# EAGLE schematic ChargerControlSchematicV1 (EAGLE 6.2)
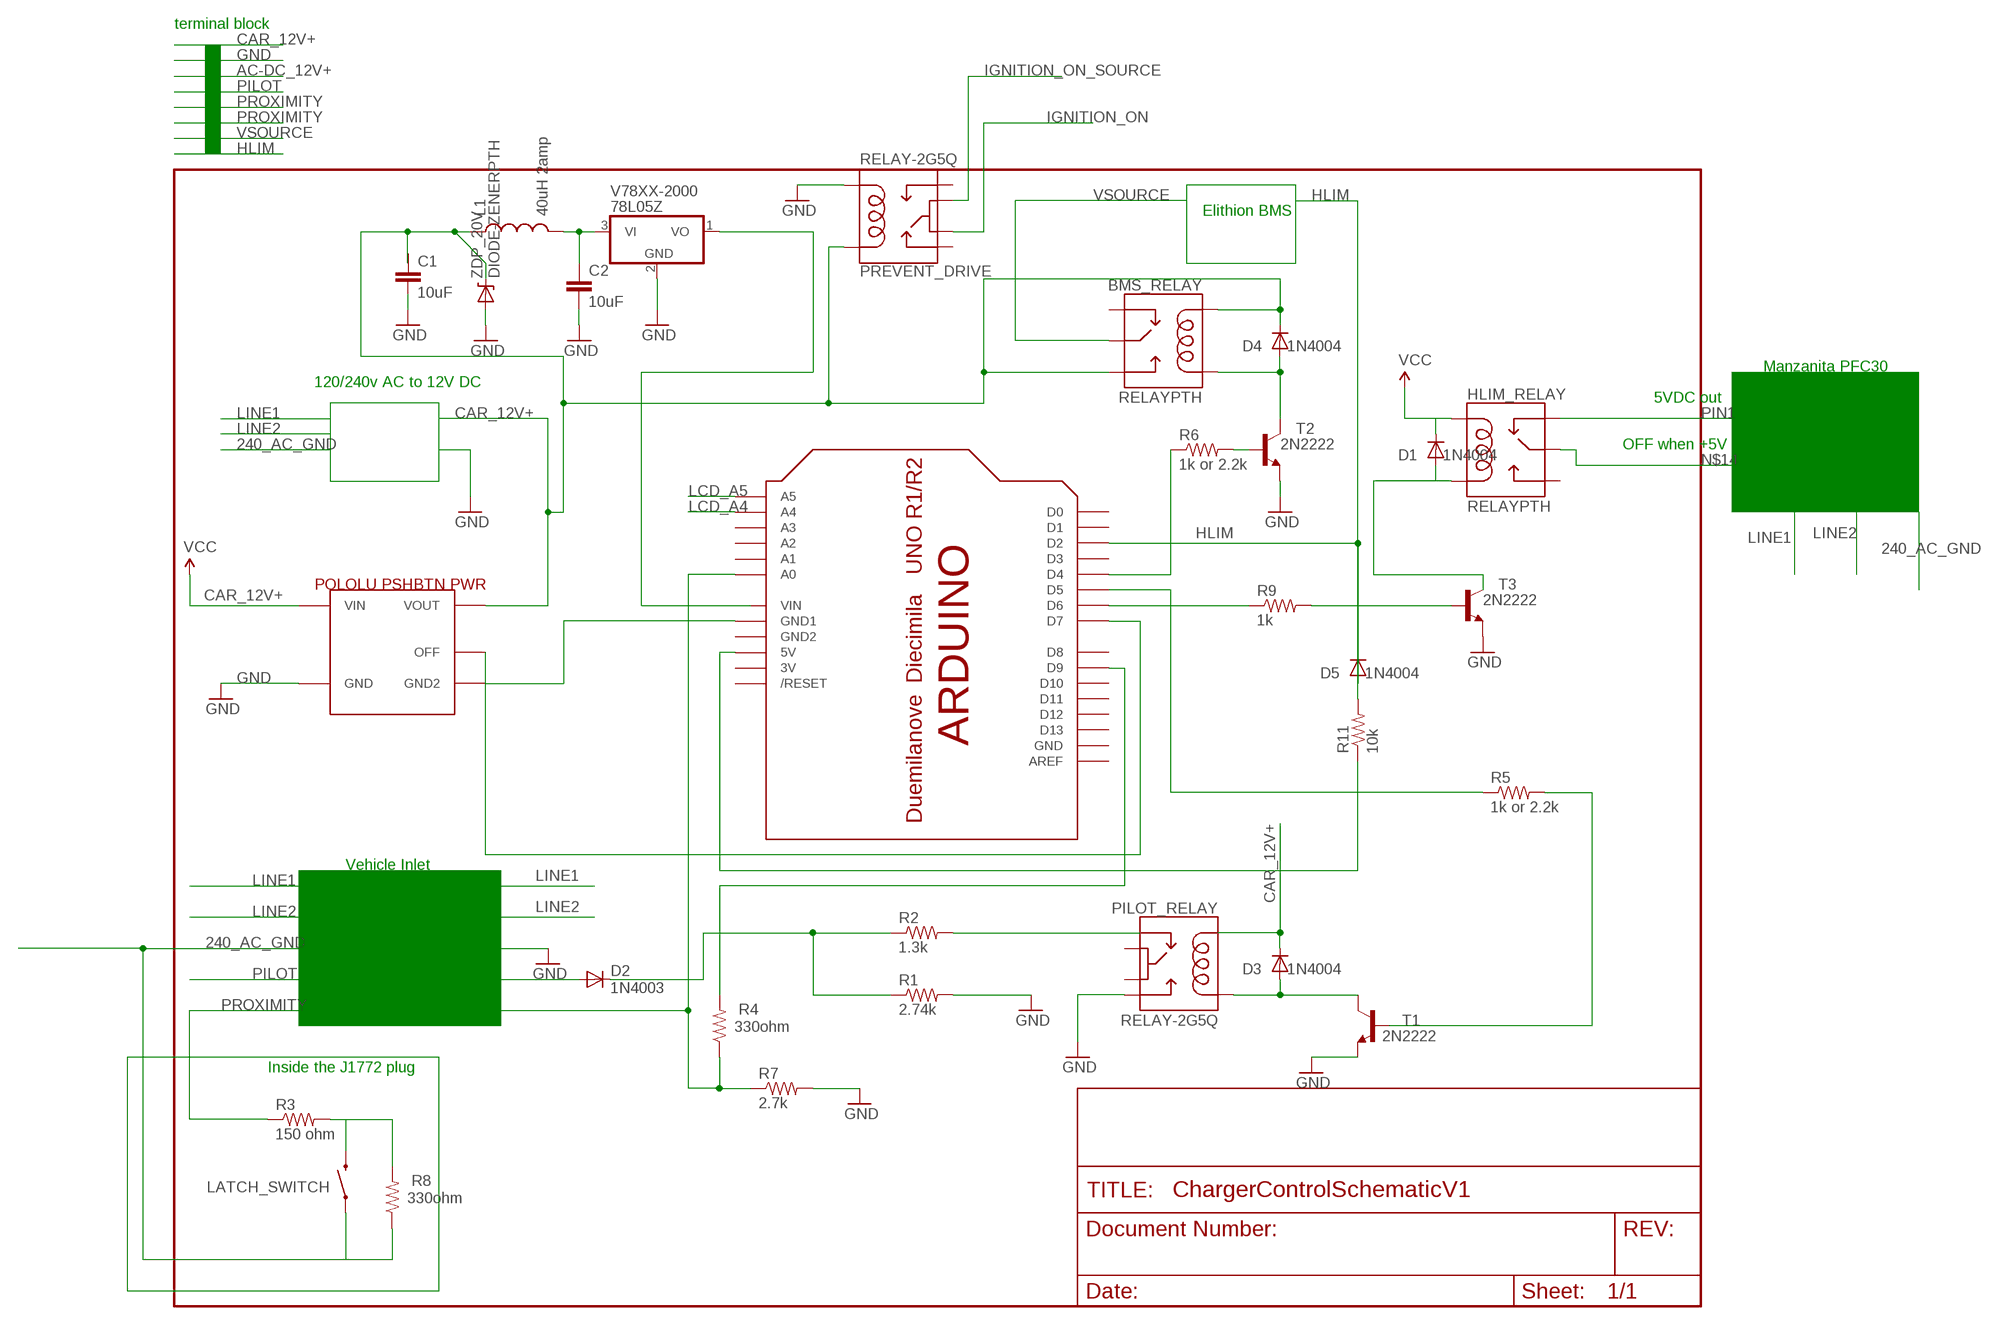
[diagram p0: schematic, sheet 1]

## Parts
BMS_RELAY  RELAYPTH  [RELAY-G5Q]
C1  10uF  CAPPTH  [CAP-PTH-SMALL]
C2  10uF  CAPPTH  [CAP-PTH-SMALL]
D1  1N4004  [DO41-10]
D2  1N4003  DIODE1N4148  [DIODE-1N4148]
D3  1N4004  [DO41-10]
D4  1N4004  [DO41-10]
D5  1N4004  [DO41-10]
HLIM_RELAY  RELAYPTH  [RELAY-G5Q]
L1  40uH 2amp  INDUCTOR.  [CDRH2D09]
LATCH_SWITCH  SWITCH-MOMENTARY-2  [TACTILE_SWITCH_TALL]
PILOT_RELAY  RELAY-2G5Q  [RELAY-G5V]
PREVENT_DRIVE  RELAY-2G5Q  [RELAY-G5V]
R1  2.74k  RESISTORKIT  [AXIAL-0.3-KIT]
R2  1.3k  RESISTORKIT  [AXIAL-0.3-KIT]
R3  150 ohm  RESISTORKIT  [AXIAL-0.3-KIT]
R4  330ohm  RESISTORKIT  [AXIAL-0.3-KIT]
R5  1k or 2.2k  RESISTORPTH-1/6W  [1/6W-RES]
R6  1k or 2.2k  RESISTORPTH-1/6W  [1/6W-RES]
R7  2.7k  RESISTORKIT  [AXIAL-0.3-KIT]
R8  330ohm  RESISTORKIT  [AXIAL-0.3-KIT]
R9  1k  RESISTORPTH-1/6W  [1/6W-RES]
R11  10k  RESISTORPTH-1/6W  [1/6W-RES]
T1  2N2222  [TO92-EBC-OVAL]
T2  2N2222  [TO92-EBC-OVAL]
T3  2N2222  [TO92-EBC-OVAL]
U$1  POLOLU_PSHBTN_PWR  [POLO_PSHBTN_PWR]
U$2  ARDUINOUNO  [ARDUINO]
V78XX-2000  78L05Z  [TO92]
ZDP_20V  DIODE-ZENERPTH  [DIODE-ZENER]

## Nets
240_AC_GND: LATCH_SWITCH.A2 R8.P$1
AC-DC-12V-OUT: U$2.VIN V78XX-2000.1(VO)
CAR_12V+: BMS_RELAY.5(COIL1) D3.C D4.C L1.P$1 PREVENT_DRIVE.2 U$1.P$4(VIN) U$1.P$5(VOUT) ZDP_20V.P$1(C) ; supply symbol labelled VCC
GND: C2.2 PREVENT_DRIVE.9 R1.P$2 R7.P$2 T1.E T2.E T3.E U$1.P$1(GND) V78XX-2000.2(GND) ZDP_20V.P$2(A)
HLIM: D5.A D5.C R11.2 U$2.D2
IGNITION_ON: PREVENT_DRIVE.5
IGNITION_ON_SOURCE: PREVENT_DRIVE.6
LCD_A4: U$2.A4
LCD_A5: U$2.A5
N$2: U$1.P$2(GND2) U$2.GND1
N$3: PILOT_RELAY.10
N$4: R9.1 U$2.D6
N$5: R6.1 U$2.D4
N$6: D2.C R1.P$1 R2.P$1
N$7: R5.2 T1.B
N$8: R2.P$2
N$9: R5.1 U$2.D5
N$10: R11.1 U$2.5V
N$11: D3.A PILOT_RELAY.9 T1.C
N$12: BMS_RELAY.1(COIL2) D4.A T2.C
N$13: R6.2 T2.B
N$14: HLIM_RELAY.2(MAIN)
N$15: D1.A HLIM_RELAY.1(COIL2) T3.C
N$16: LATCH_SWITCH.B2 R3.P$2 R8.P$2
N$17: C2.1 L1.P$2 V78XX-2000.3(VI)
N$18: R4.P$2 U$2.D9
PILOT: D2.A
PILOT_RELAY: U$1.P$3(OFF) U$2.D7
PIN1: HLIM_RELAY.4(NC)
PIN2: R9.2 T3.B
PROXIMITY: R3.P$1 R4.P$1 R7.P$1 U$2.A0
VCC: D1.C HLIM_RELAY.5(COIL1)
Unconnected: BMS_RELAY.2(MAIN) BMS_RELAY.3(NO) BMS_RELAY.4(NC) C1.1 C1.2 HLIM_RELAY.3(NO) PILOT_RELAY.1 PILOT_RELAY.2 PILOT_RELAY.5 PILOT_RELAY.6 PREVENT_DRIVE.1 PREVENT_DRIVE.10 U$2.A1 U$2.A2 U$2.A3 U$2.AREF U$2.D0 U$2.D1 U$2.D3 U$2.D8 U$2.D10 U$2.D11 U$2.D12 U$2.D13 U$2.RESET(/RESET)

## Notes on the sheet
- terminal block
- Elithion BMS
- Manzanita PFC30
- 120/240v AC to 12V DC
- 5VDC out
- OFF when +5V
- Vehicle Inlet
- Inside the J1772 plug

## Power pins joined to a net without a drawn wire
3V: U$2.3V
GND: U$2.GND
GND2: U$2.GND2

## Library data of the parts
BMS_RELAY HLIM_RELAY = SparkFun:RELAY
C1 C2 = SparkFun:CAP: Capacitor Standard 0603 ceramic capacitor, and 0.1" leaded capacitor.
D1 D3-D5 = adafruit:1N4004: DIODE General purpose 1N400x type rectifier (With bigger pads) http://www.ladyada.net/library/pcb/eaglelibrary.html
D2 = SparkFun:DIODE: Diode These are standard reverse protection diodes and small signal diodes. SMA package can handle up to about 1A. SOD-323 can handle about 200mA. What the SOD-323 package when ordering, there are some mfgs out there that are 5-pin packages.
L1 = SparkFun:INDUCTOR: Inductors Basic Inductor/Choke - 0603 and 1206. Footprints are not proven and vary greatly between part numbers.
LATCH_SWITCH = SparkFun:SWITCH-MOMENTARY-2
PILOT_RELAY PREVENT_DRIVE = SparkFun:RELAY-2
R1-R9 R11 = SparkFun:RESISTOR: Resistor Basic schematic elements and footprints for 0603, 1206, and PTH resistors.
T1-T3 = adafruit:2N2222: NPN TRANSISTOR Big oval pads
U$1 = ChargerControlLibrary:POLOLU_PSHBTN_PWR: Pololu PushButton Switch
U$2 = adafruit:ARDUINO: Arduino Diecimila/Duemilanove Make a shield with ease, this package has all the named pins as well as the two mounting drill holes and an outline of the USB and DC power connector. The outline is on the DIMENSION layer, so if your board house uses it they will cut the outline to match. http://www.ladyada.net/library/pcb/eaglelibrary.html
V78XX-2000 = linear:78*: Positive VOLTAGE REGULATOR Source: http://cache.national.com/ds/LM/LM78L05.pdf http://www.fairchildsemi.com/ds/LM/LM7805.pdf
ZDP_20V = SparkFun:DIODE-ZENER: Zener Diode Production Part - 8199 3.4V Zener Voltage